# EAGLE design MOS-2 (EAGLE 8.5.2)
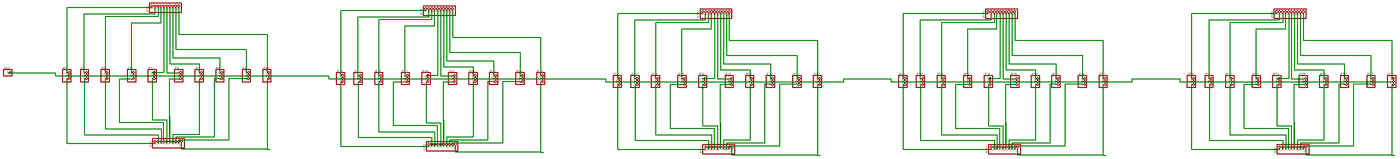
[diagram p0: schematic, sheet 1, overview]
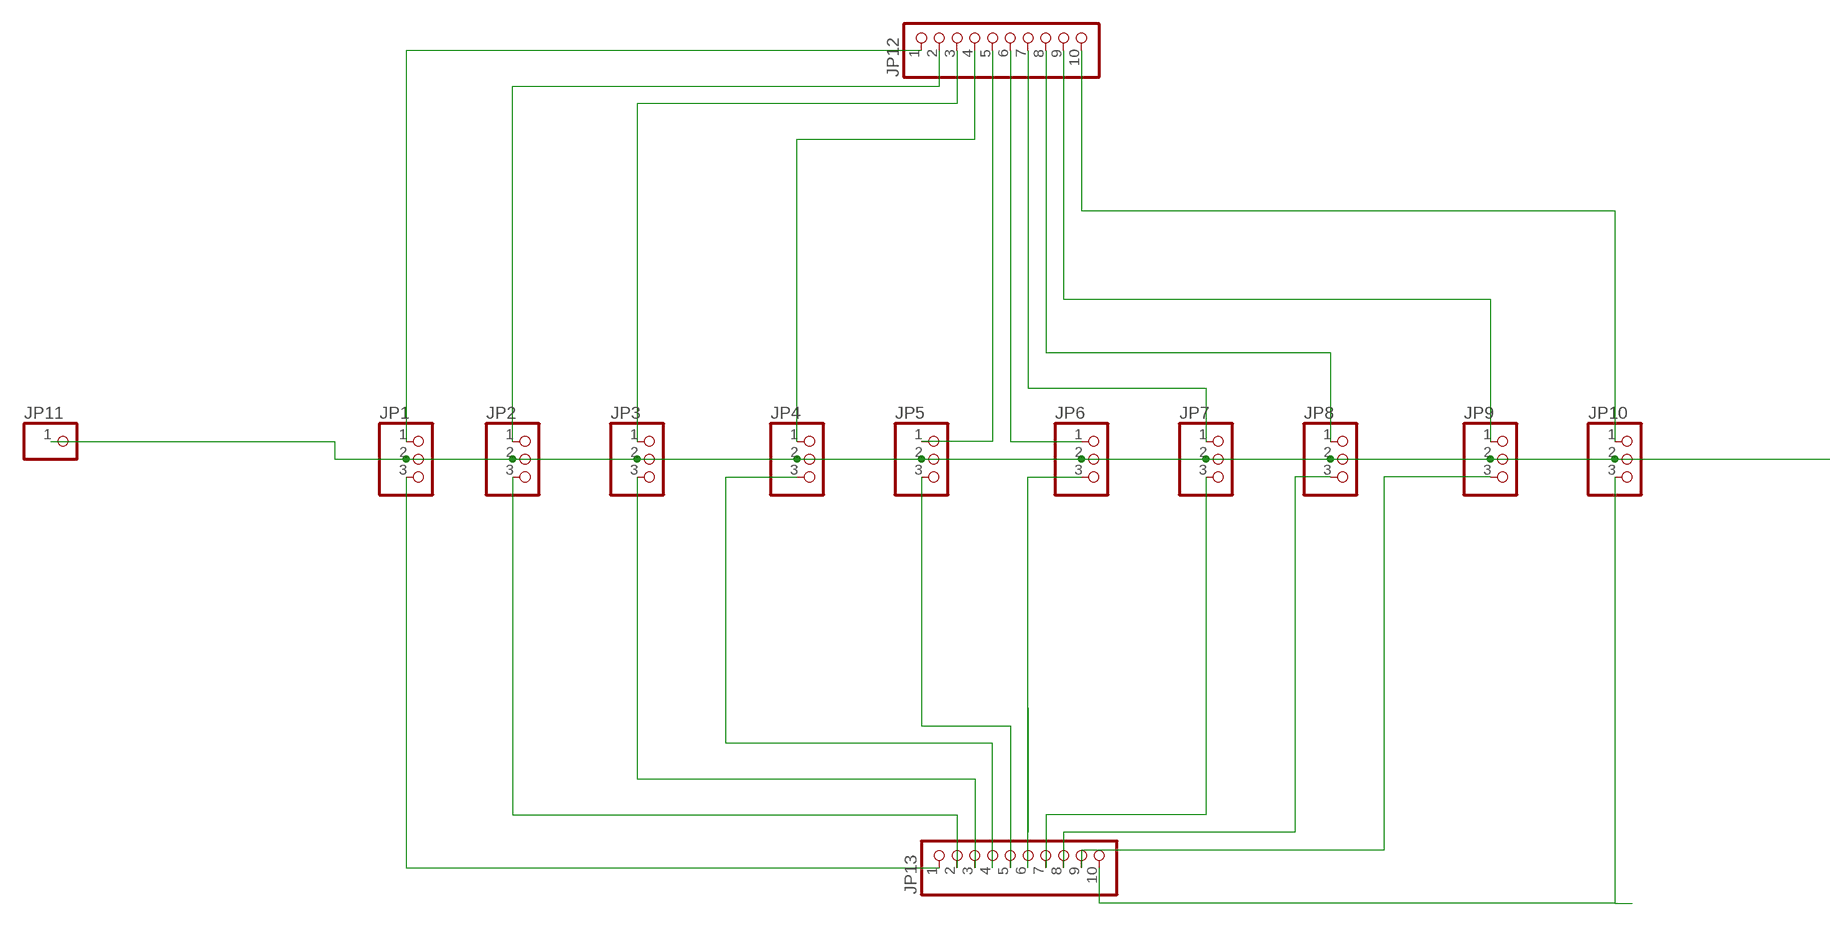
[diagram p1: schematic, sheet 1, part 1 of 4]
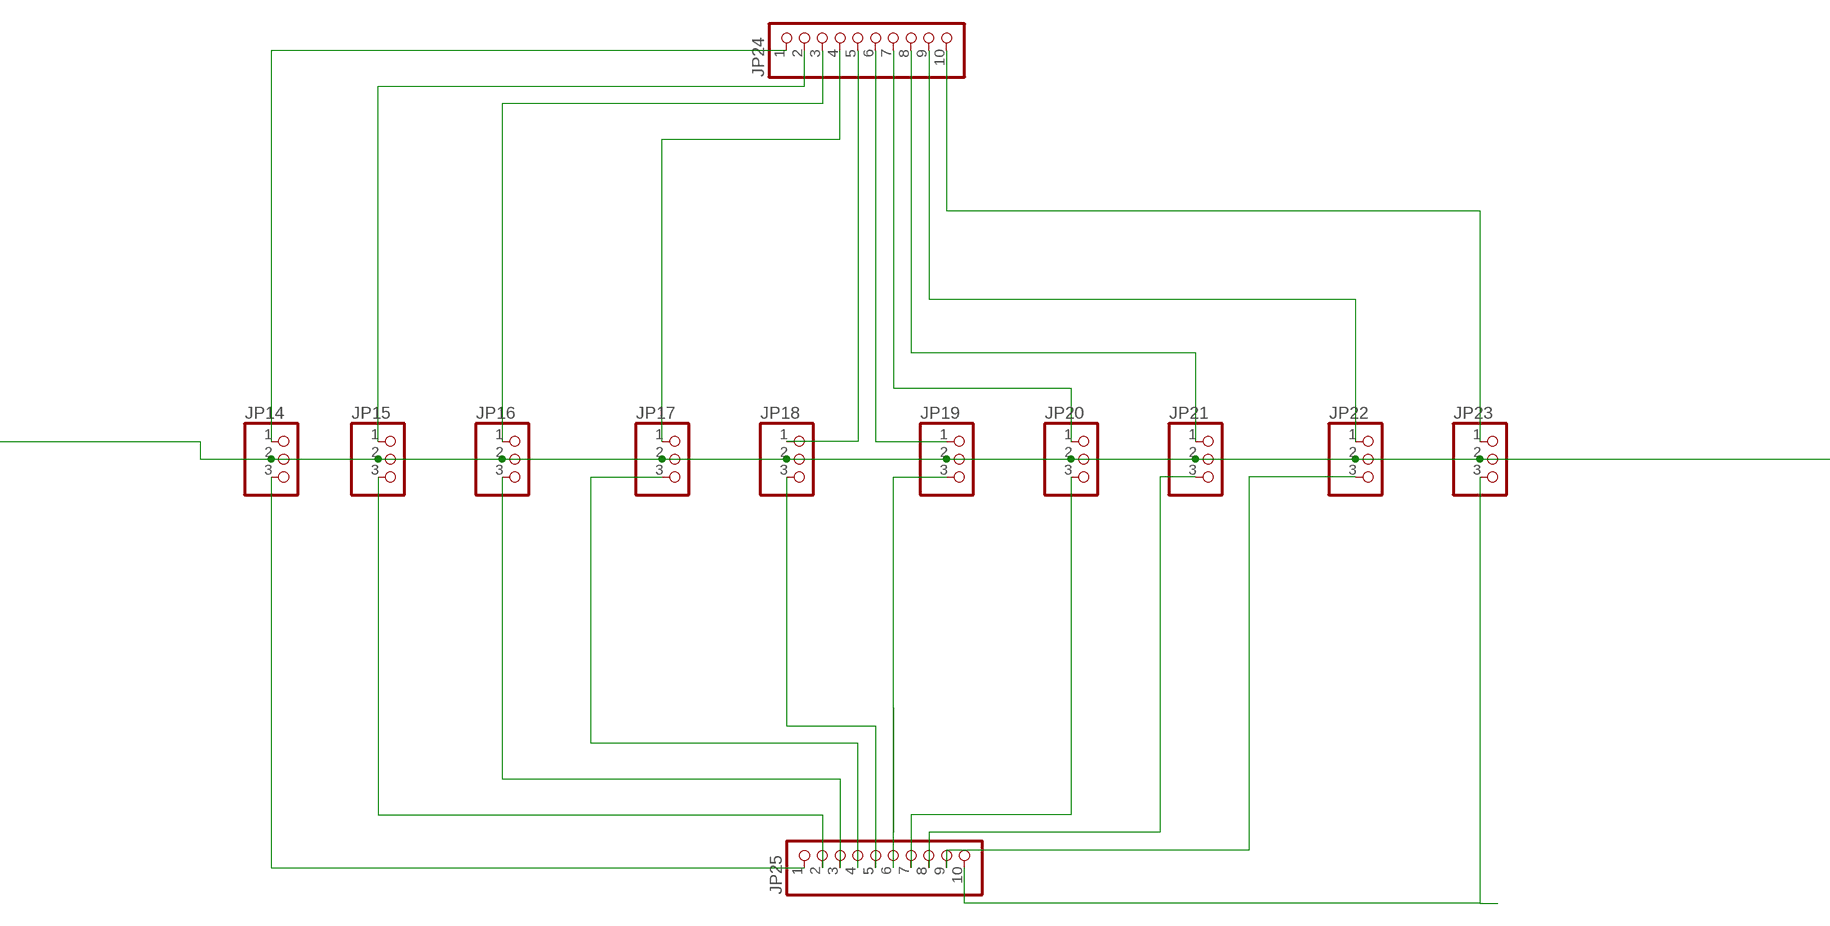
[diagram p2: schematic, sheet 1, part 2 of 4]
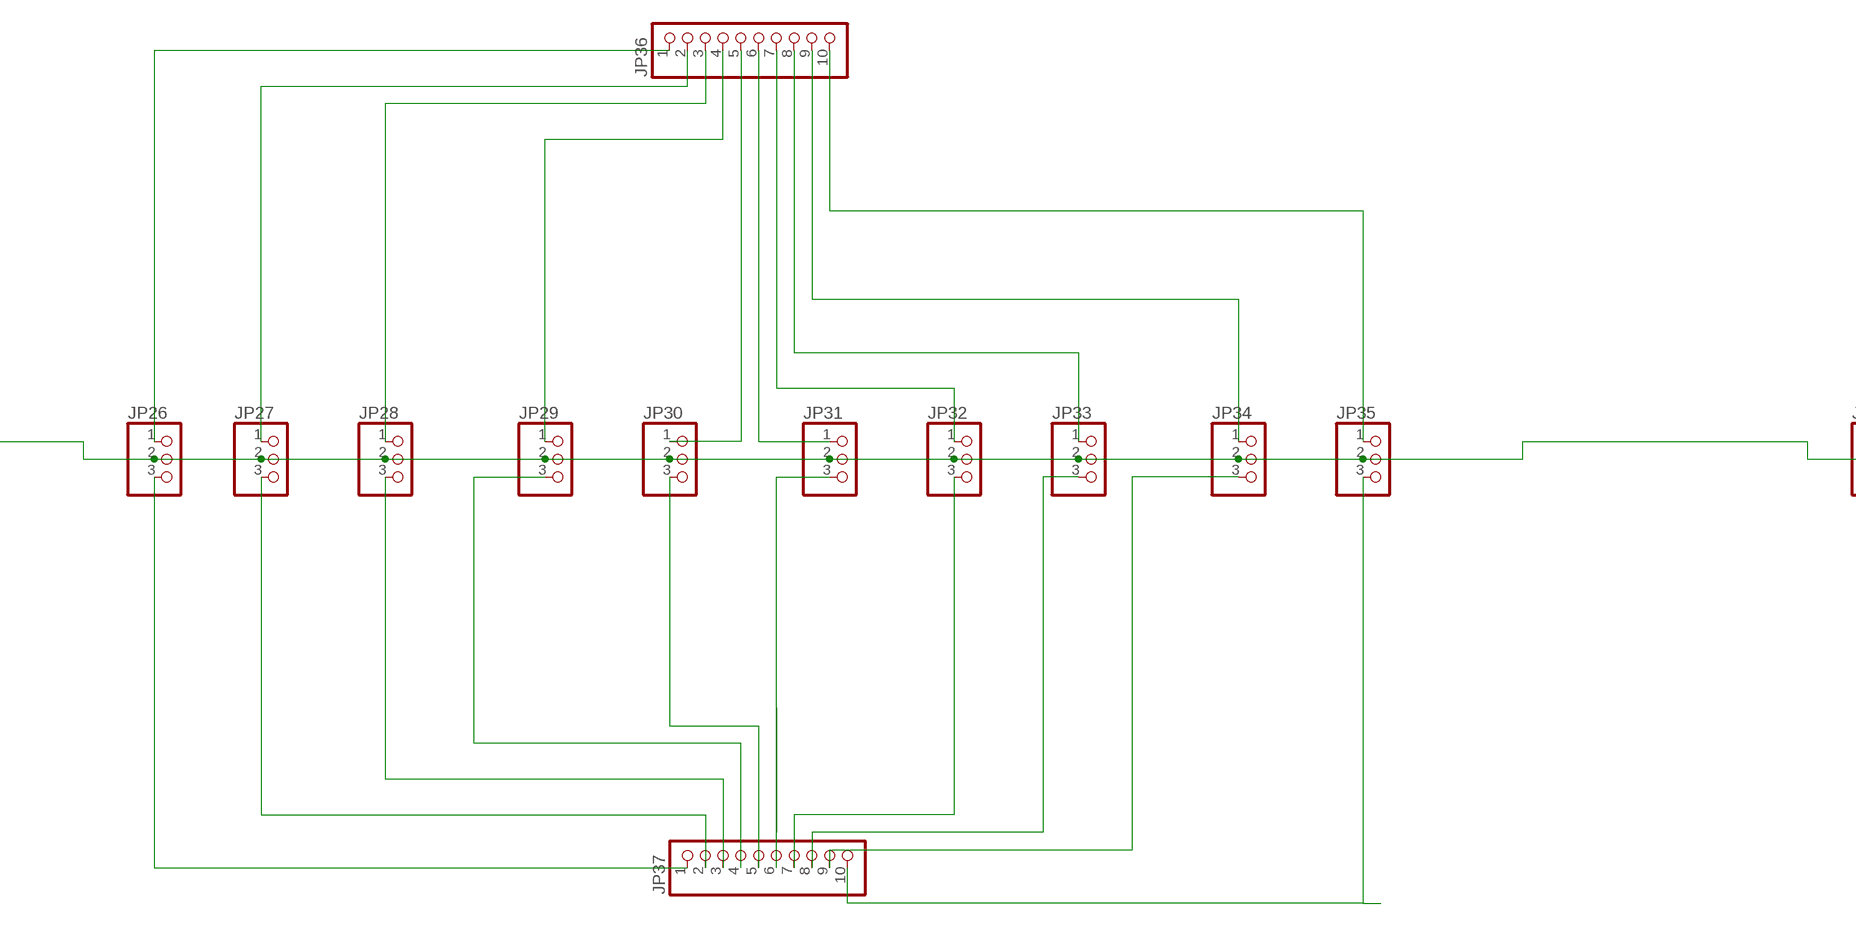
[diagram p3: schematic, sheet 1, part 3 of 4]
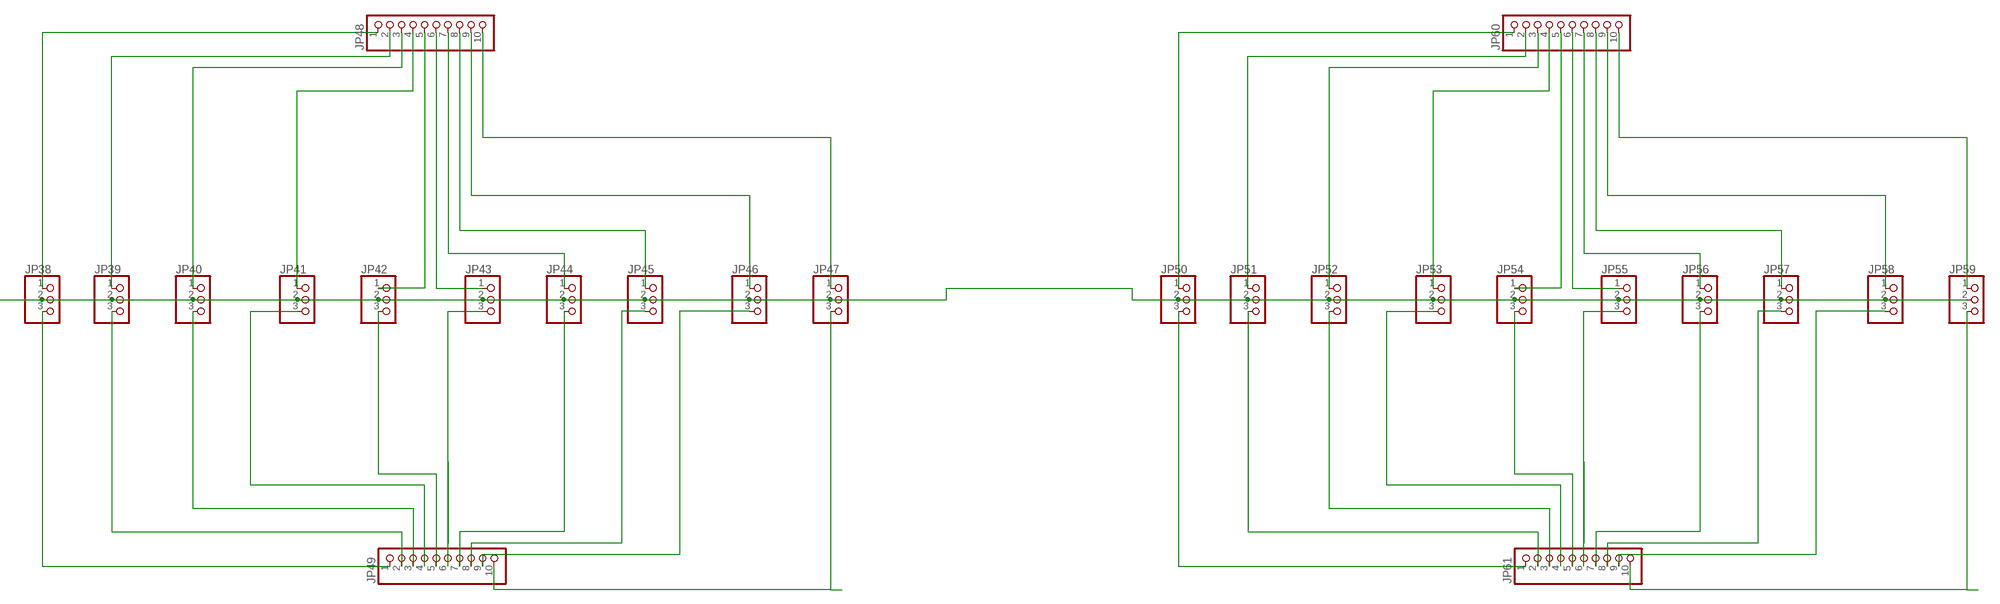
[diagram p4: schematic, sheet 1, part 4 of 4]

## Parts
JP1  PINHD-1X3  [1X03]
JP2  PINHD-1X3  [1X03]
JP3  PINHD-1X3  [1X03]
JP4  PINHD-1X3  [1X03]
JP5  PINHD-1X3  [1X03]
JP6  PINHD-1X3  [1X03]
JP7  PINHD-1X3  [1X03]
JP8  PINHD-1X3  [1X03]
JP9  PINHD-1X3  [1X03]
JP10  PINHD-1X3  [1X03]
JP11  PINHD-1X1  [1X01]
JP12  PINHD-1X10  [1X10]
JP13  PINHD-1X10  [1X10]
JP14  PINHD-1X3  [1X03]
JP15  PINHD-1X3  [1X03]
JP16  PINHD-1X3  [1X03]
JP17  PINHD-1X3  [1X03]
JP18  PINHD-1X3  [1X03]
JP19  PINHD-1X3  [1X03]
JP20  PINHD-1X3  [1X03]
JP21  PINHD-1X3  [1X03]
JP22  PINHD-1X3  [1X03]
JP23  PINHD-1X3  [1X03]
JP24  PINHD-1X10  [1X10]
JP25  PINHD-1X10  [1X10]
JP26  PINHD-1X3  [1X03]
JP27  PINHD-1X3  [1X03]
JP28  PINHD-1X3  [1X03]
JP29  PINHD-1X3  [1X03]
JP30  PINHD-1X3  [1X03]
JP31  PINHD-1X3  [1X03]
JP32  PINHD-1X3  [1X03]
JP33  PINHD-1X3  [1X03]
JP34  PINHD-1X3  [1X03]
JP35  PINHD-1X3  [1X03]
JP36  PINHD-1X10  [1X10]
JP37  PINHD-1X10  [1X10]
JP38  PINHD-1X3  [1X03]
JP39  PINHD-1X3  [1X03]
JP40  PINHD-1X3  [1X03]
JP41  PINHD-1X3  [1X03]
JP42  PINHD-1X3  [1X03]
JP43  PINHD-1X3  [1X03]
JP44  PINHD-1X3  [1X03]
JP45  PINHD-1X3  [1X03]
JP46  PINHD-1X3  [1X03]
JP47  PINHD-1X3  [1X03]
JP48  PINHD-1X10  [1X10]
JP49  PINHD-1X10  [1X10]
JP50  PINHD-1X3  [1X03]
JP51  PINHD-1X3  [1X03]
JP52  PINHD-1X3  [1X03]
JP53  PINHD-1X3  [1X03]
JP54  PINHD-1X3  [1X03]
JP55  PINHD-1X3  [1X03]
JP56  PINHD-1X3  [1X03]
JP57  PINHD-1X3  [1X03]
JP58  PINHD-1X3  [1X03]
JP59  PINHD-1X3  [1X03]
JP60  PINHD-1X10  [1X10]
JP61  PINHD-1X10  [1X10]

## Nets
N$1: JP1.2 JP2.2 JP3.2 JP4.2 JP5.2 JP6.2 JP7.2 JP8.2 JP9.2 JP10.2 JP11.1 JP14.2 JP15.2 JP16.2 JP17.2 JP18.2 JP19.2 JP20.2 JP21.2 JP22.2 JP23.2 JP26.2 JP27.2 JP28.2 JP29.2 JP30.2 JP31.2 JP32.2 JP33.2 JP34.2 JP35.2 JP38.2 JP39.2 JP40.2 JP41.2 JP42.2 JP43.2 JP44.2 JP45.2 JP46.2 JP47.2 JP50.2 JP51.2 JP52.2 JP53.2 JP54.2 JP55.2 JP56.2 JP57.2 JP58.2 JP59.2
N$2: JP1.1 JP12.1
N$3: JP2.1 JP12.2
N$4: JP3.1 JP12.3
N$5: JP4.1 JP12.4
N$6: JP5.1 JP12.5
N$7: JP6.1 JP12.6
N$8: JP7.1 JP12.7
N$9: JP8.1 JP12.8
N$10: JP9.1 JP12.9
N$11: JP10.1 JP12.10
N$12: JP1.3 JP13.1
N$13: JP2.3 JP13.2
N$14: JP3.3 JP13.3
N$16: JP5.3 JP13.5
N$17: JP10.3 JP13.10
N$18: JP9.3 JP13.9
N$19: JP8.3 JP13.8
N$20: JP7.3 JP13.7
N$21: JP6.3 JP13.6
N$22: JP14.1 JP24.1
N$23: JP4.3 JP13.4
N$24: JP15.1 JP24.2
N$26: JP16.1 JP24.3
N$27: JP17.1 JP24.4
N$28: JP18.1 JP24.5
N$29: JP19.1 JP24.6
N$30: JP20.1 JP24.7
N$31: JP21.1 JP24.8
N$32: JP22.1 JP24.9
N$33: JP23.1 JP24.10
N$34: JP14.3 JP25.1
N$35: JP15.3 JP25.2
N$36: JP16.3 JP25.3
N$37: JP18.3 JP25.5
N$38: JP23.3 JP25.10
N$39: JP22.3 JP25.9
N$40: JP21.3 JP25.8
N$41: JP20.3 JP25.7
N$42: JP19.3 JP25.6
N$43: JP17.3 JP25.4
N$46: JP26.1 JP36.1
N$47: JP27.1 JP36.2
N$48: JP28.1 JP36.3
N$49: JP29.1 JP36.4
N$50: JP30.1 JP36.5
N$51: JP31.1 JP36.6
N$52: JP32.1 JP36.7
N$53: JP33.1 JP36.8
N$54: JP34.1 JP36.9
N$55: JP35.1 JP36.10
N$56: JP26.3 JP37.1
N$57: JP27.3 JP37.2
N$58: JP28.3 JP37.3
N$59: JP30.3 JP37.5
N$60: JP35.3 JP37.10
N$61: JP34.3 JP37.9
N$62: JP33.3 JP37.8
N$63: JP32.3 JP37.7
N$64: JP31.3 JP37.6
N$65: JP29.3 JP37.4
N$68: JP38.1 JP48.1
N$69: JP39.1 JP48.2
N$70: JP40.1 JP48.3
N$71: JP41.1 JP48.4
N$72: JP42.1 JP48.5
N$73: JP43.1 JP48.6
N$74: JP44.1 JP48.7
N$75: JP45.1 JP48.8
N$76: JP46.1 JP48.9
N$77: JP47.1 JP48.10
N$78: JP38.3 JP49.1
N$79: JP39.3 JP49.2
N$80: JP40.3 JP49.3
N$81: JP42.3 JP49.5
N$82: JP47.3 JP49.10
N$83: JP46.3 JP49.9
N$84: JP45.3 JP49.8
N$85: JP44.3 JP49.7
N$86: JP43.3 JP49.6
N$87: JP41.3 JP49.4
N$90: JP50.1 JP60.1
N$91: JP51.1 JP60.2
N$92: JP52.1 JP60.3
N$93: JP53.1 JP60.4
N$94: JP54.1 JP60.5
N$95: JP55.1 JP60.6
N$96: JP56.1 JP60.7
N$97: JP57.1 JP60.8
N$98: JP58.1 JP60.9
N$99: JP59.1 JP60.10
N$100: JP50.3 JP61.1
N$101: JP51.3 JP61.2
N$102: JP52.3 JP61.3
N$103: JP54.3 JP61.5
N$104: JP59.3 JP61.10
N$105: JP58.3 JP61.9
N$106: JP57.3 JP61.8
N$107: JP56.3 JP61.7
N$108: JP55.3 JP61.6
N$109: JP53.3 JP61.4

## Library data of the parts
JP1-JP10 JP14-JP23 JP26-JP35 JP38-JP47 JP50-JP59 = pinhead:PINHD-1X3: PIN HEADER
JP11 = pinhead:PINHD-1X1: PIN HEADER
JP12 JP13 JP24 JP25 JP36 JP37 JP48 JP49 JP60 JP61 = pinhead:PINHD-1X10: PIN HEADER

## Net classes
0 default: width 1 mm, clearance 0.5 mm

## Board
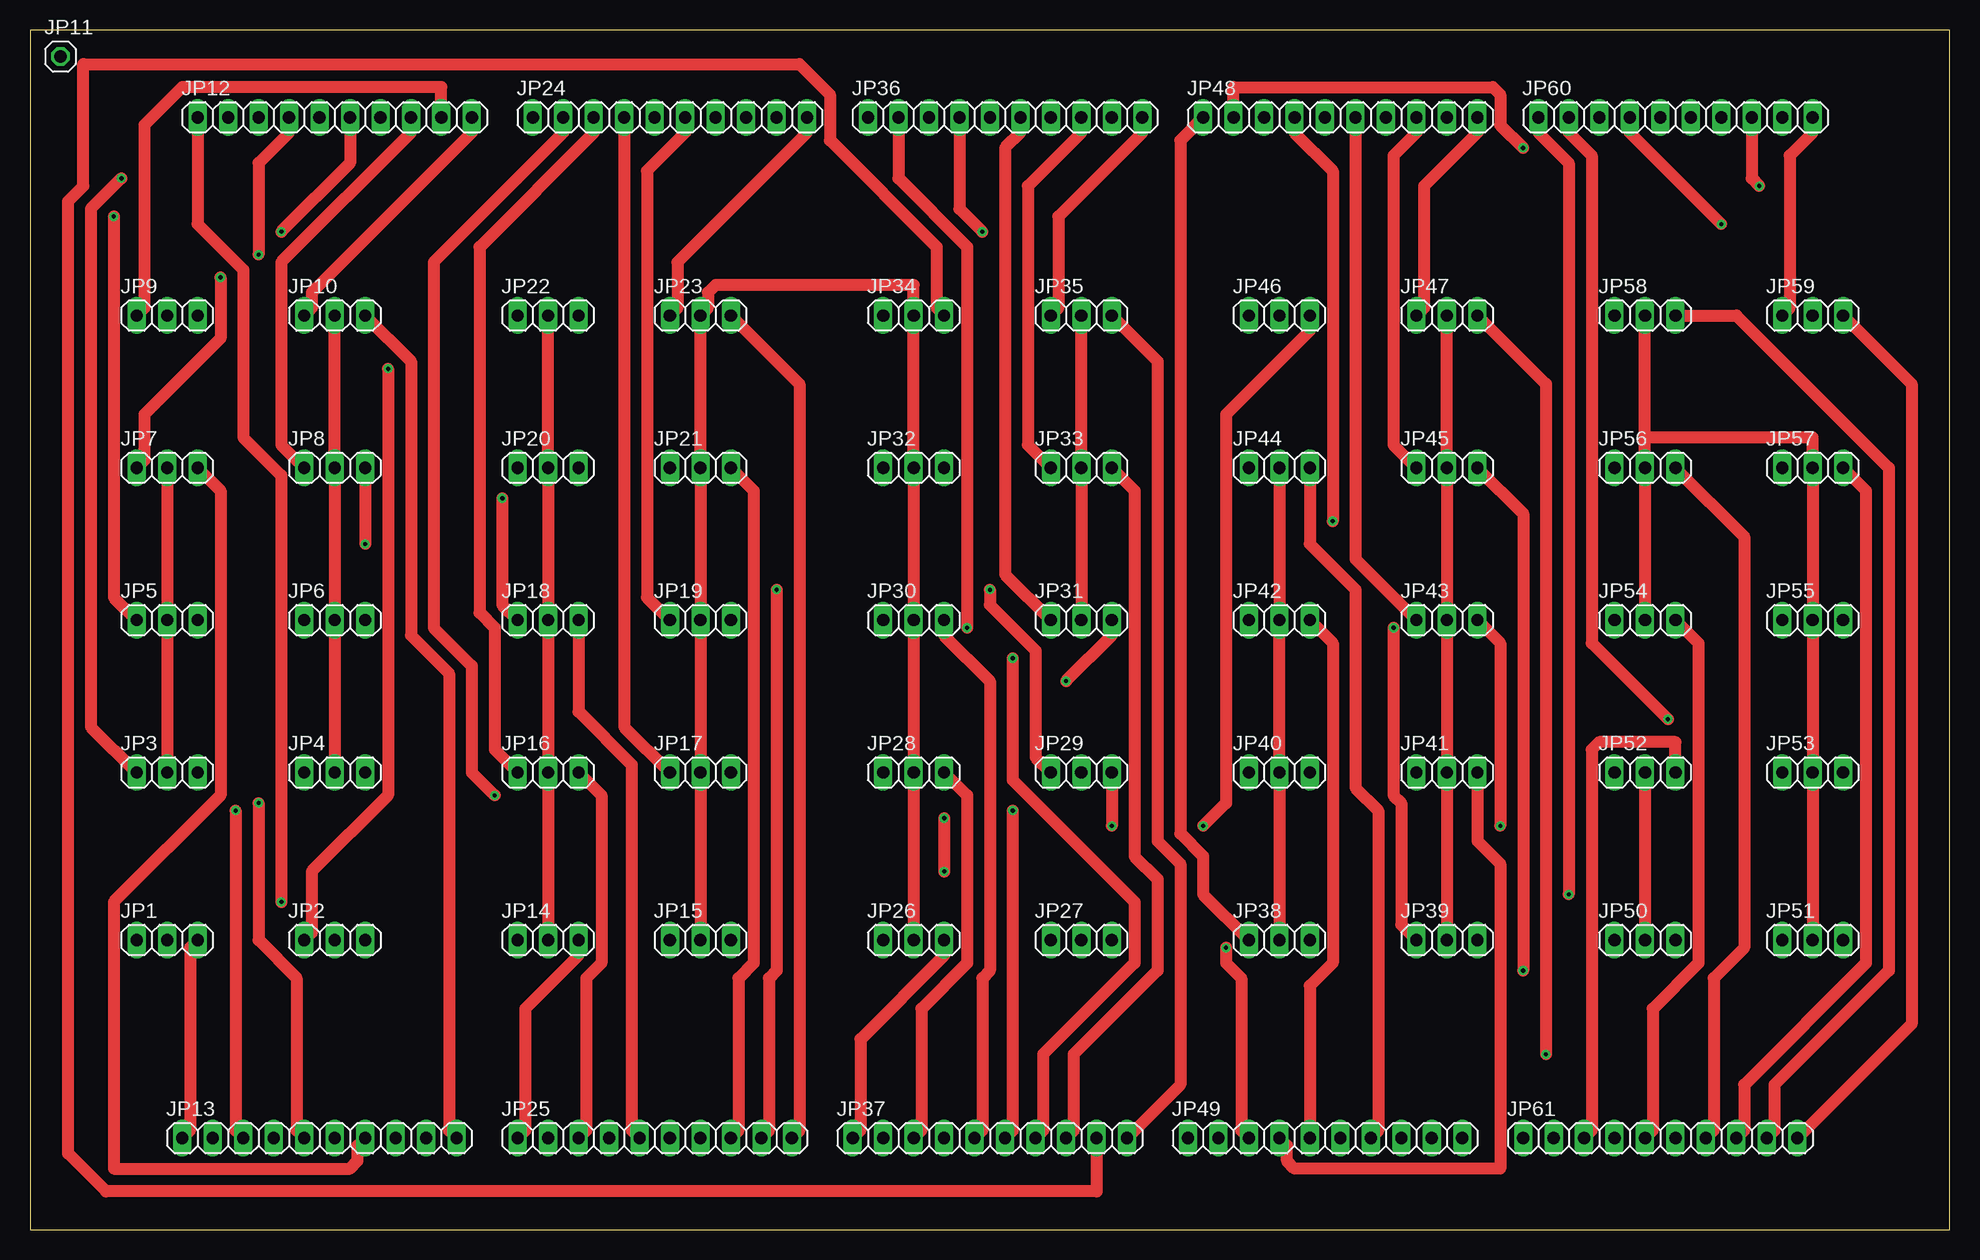
[diagram p5: board, top side]
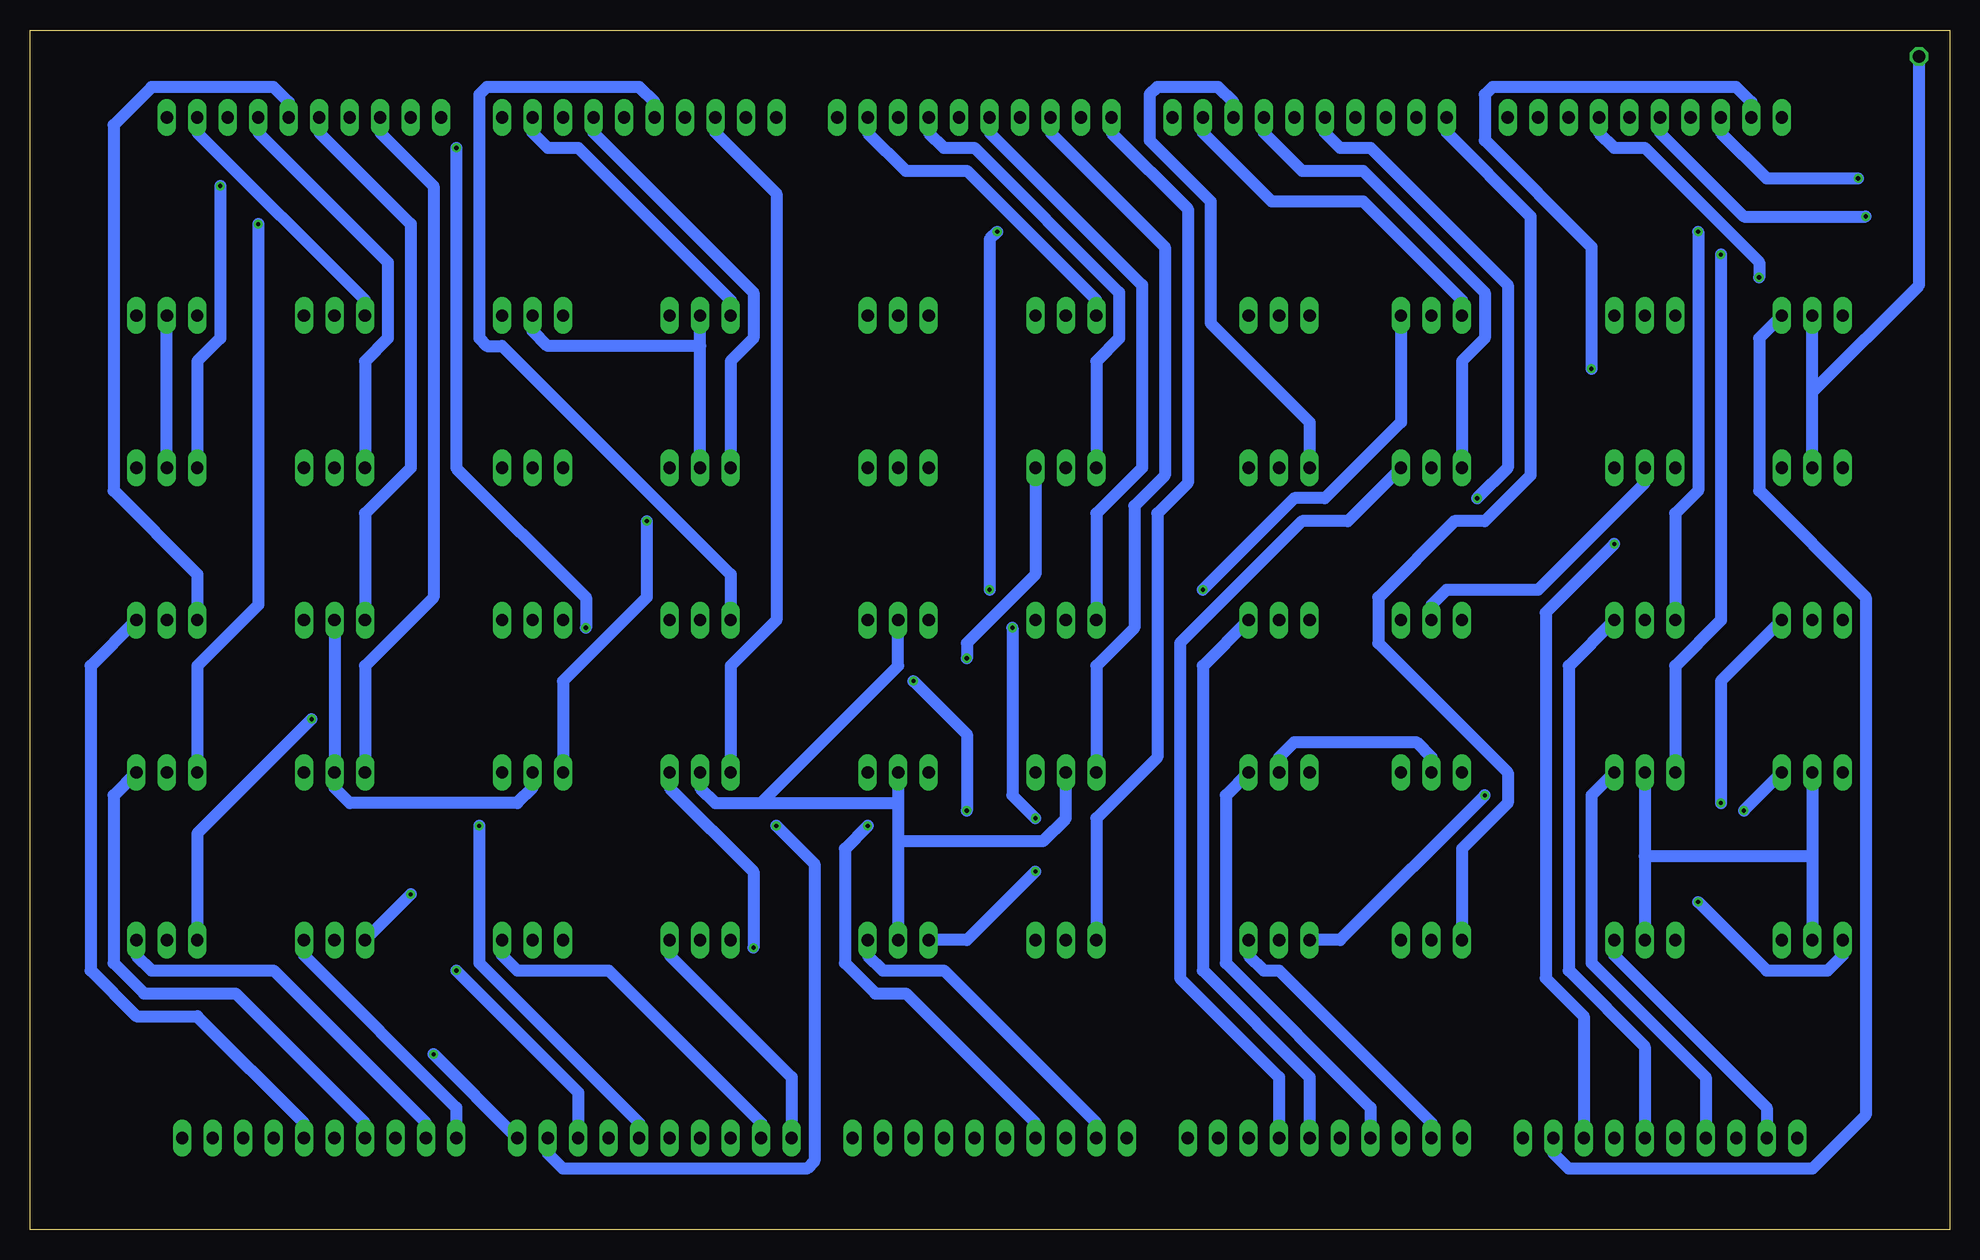
[diagram p6: board, bottom side, seen from below]

Size 160 x 100 mm. Coordinates in mm from the lower left corner, seen from the top.
Outline: 0,0 160,0 160,100 0,100 0,0
Copper layers (1*16): Top 0.035mm / dielectric 1.5mm / Bottom 0.035mm
Design rules "default": minimum track width 6mil, minimum drill 0.35mm, track to track 6mil, track to pad 6mil, pad to pad 6mil, via to via 6mil, smd to smd 6mil, copper to edge 40mil, drill to drill 6mil, minimum pad ring 10mil, minimum via ring 8mil, stop-mask expansion 4mil, vias tented up to drill 0mil, thermal gap 10mil

### Footprints (pad centres in the part's own frame; a part is rotated, then mirrored left to right if it is on the bottom)
1X03 = drill 1.016 long: 1 -2.54,0; 2 0,0; 3 2.54,0
1X01 = drill 1.016 octagon: 1 0,0
1X10 = drill 1.016 long: 1 -11.43,0; 2 -8.89,0; 3 -6.35,0; 4 -3.81,0; 5 -1.27,0; 6 1.27,0; 7 3.81,0; 8 6.35,0; 9 8.89,0; 10 11.43,0

### Placement (x,y rotation side)
JP1  11.43,24.13 0 top
JP2  25.4,24.13 0 top
JP3  11.43,38.1 0 top
JP4  25.4,38.1 0 top
JP5  11.43,50.8 0 top
JP6  25.4,50.8 0 top
JP7  11.43,63.5 0 top
JP8  25.4,63.5 0 top
JP9  11.43,76.2 0 top
JP10  25.4,76.2 0 top
JP11  2.54,97.79 0 top
JP12  25.4,92.71 0 top
JP13  24.13,7.62 0 top
JP14  43.18,24.13 0 top
JP15  55.88,24.13 0 top
JP16  43.18,38.1 0 top
JP17  55.88,38.1 0 top
JP18  43.18,50.8 0 top
JP19  55.88,50.8 0 top
JP20  43.18,63.5 0 top
JP21  55.88,63.5 0 top
JP22  43.18,76.2 0 top
JP23  55.88,76.2 0 top
JP24  53.34,92.71 0 top
JP25  52.07,7.62 0 top
JP26  73.66,24.13 0 top
JP27  87.63,24.13 0 top
JP28  73.66,38.1 0 top
JP29  87.63,38.1 0 top
JP30  73.66,50.8 0 top
JP31  87.63,50.8 0 top
JP32  73.66,63.5 0 top
JP33  87.63,63.5 0 top
JP34  73.66,76.2 0 top
JP35  87.63,76.2 0 top
JP36  81.28,92.71 0 top
JP37  80.01,7.62 0 top
JP38  104.14,24.13 0 top
JP39  118.11,24.13 0 top
JP40  104.14,38.1 0 top
JP41  118.11,38.1 0 top
JP42  104.14,50.8 0 top
JP43  118.11,50.8 0 top
JP44  104.14,63.5 0 top
JP45  118.11,63.5 0 top
JP46  104.14,76.2 0 top
JP47  118.11,76.2 0 top
JP48  109.22,92.71 0 top
JP49  107.95,7.62 0 top
JP50  134.62,24.13 0 top
JP51  148.59,24.13 0 top
JP52  134.62,38.1 0 top
JP53  148.59,38.1 0 top
JP54  134.62,50.8 0 top
JP55  148.59,50.8 0 top
JP56  134.62,63.5 0 top
JP57  148.59,63.5 0 top
JP58  134.62,76.2 0 top
JP59  148.59,76.2 0 top
JP60  137.16,92.71 0 top
JP61  135.89,7.62 0 top

### Tracks (layer width: path | path; a pad name or v marks a point on that pad's centre or on a via)
N$1
  Top 1: JP10.2 JP8.2 JP6.2 JP4.2 | JP7.2 JP5.2 JP3.2 | JP52.2 JP50.2 | JP54.2 JP56.2 134.62,66.04 | 134.62,66.04 JP58.2 | JP51.2 JP53.2 JP55.2 JP57.2 148.59,66.04 134.62,66.04 | JP14.2 JP16.2 JP18.2 JP20.2 JP22.2 | JP15.2 JP17.2 JP19.2 JP21.2 JP23.2 56.52,76.83 56.52,78.11 57.15,78.74 73.66,78.74 JP34.2 JP32.2 JP30.2 JP28.2 JP26.2 | JP39.2 JP41.2 JP43.2 JP45.2 JP47.2 | JP44.2 JP42.2 JP40.2 JP38.2 | JP31.2 JP33.2 JP35.2
  Bottom 1: JP4.2 25.4,31.11 | 25.4,31.11 JP2.2 | JP3.2 11.43,31.11 | 11.43,31.11 JP1.2 | JP7.2 11.43,69.85 | 11.43,69.85 JP9.2 | JP11.1 2.54,78.74 11.43,69.85 | 11.43,31.11 25.4,31.11 | JP54.2 JP52.2 134.62,36.83 133.35,35.56 119.38,35.56 118.11,36.83 JP41.2 | JP57.2 JP59.2 | JP16.2 43.18,39.37 44.45,40.64 54.61,40.64 55.88,39.37 JP17.2 | JP44.2 104.14,73.66 | 104.14,73.66 JP46.2 | JP29.2 87.63,35.56 | 87.63,35.56 87.63,32.38 | 87.63,32.38 JP27.2 | 99.06,35.56 102.87,35.56 104.14,36.83 JP40.2 | 99.06,35.56 87.63,35.56 | JP31.2 87.63,46.99 99.06,35.56 | JP28.2 73.66,34.29 75.56,32.38 87.63,32.38 | JP47.2 118.11,74.93 116.84,73.66 104.14,73.66 | JP8.2 25.4,62.23 34.29,53.34 41.91,53.34 43.18,52.07 JP18.2
N$2  (via drill 0.35)
  Top 1: v20.95,27.3 20.95,62.87 17.78,66.04 17.78,80.01 13.97,83.82 JP12.1
  Bottom 1: JP1.1 8.89,22.86 10.16,21.59 15.24,21.59 v20.95,27.3
N$3  (via drill 0.35)
  Top 1: JP2.1 23.5,24.77 23.5,29.84 29.84,36.2 v29.84,71.75
  Bottom 1: v29.84,71.75 29.84,81.92 38.73,90.81 38.73,94.61 38.1,95.25 17.78,95.25 16.51,93.98 JP12.2
N$4  (via drill 0.35)
  Top 1: JP3.1 5.08,41.91 5.08,85.09 v7.62,87.63
  Bottom 1: v7.62,87.63 15.24,87.63 19.05,91.44 JP12.3
N$5  (via drill 0.35)
  Top 1: v19.05,81.28 19.05,88.9 21.59,91.44 JP12.4
  Bottom 1: JP4.1 22.86,46.99 19.05,50.8 v19.05,81.28
N$6  (via drill 0.35)
  Top 1: JP5.1 6.99,52.7 v6.99,84.45
  Bottom 1: v6.99,84.45 17.14,84.45 24.13,91.44 JP12.5
N$7  (via drill 0.35)
  Top 1: v20.95,83.19 26.67,88.9 JP12.6
  Bottom 1: JP6.1 22.86,59.69 20.95,61.59 v20.95,83.19
N$8  (via drill 0.35)
  Top 1: JP7.1 9.53,64.14 9.53,67.94 15.88,74.3 v15.88,79.38
  Bottom 1: v15.88,79.38 15.88,80.64 25.4,90.17 27.94,90.17 29.21,91.44 JP12.7
N$9
  Top 1: JP8.1 20.95,65.41 20.95,80.64 31.75,91.44 JP12.8
N$10
  Top 1: JP9.1 9.53,76.83 9.53,92.08 12.7,95.25 34.29,95.25 JP12.9
N$11
  Top 1: JP10.1 23.5,76.83 23.5,78.11 36.83,91.44 JP12.10
N$12
  Top 1: JP13.1 13.34,8.26 13.34,23.5 JP1.3
N$13
  Bottom 1: JP13.2 15.24,10.16 27.94,22.86 JP2.3
N$14  (via drill 0.35)
  Top 1: JP13.3 17.14,8.26 v17.14,34.92
  Bottom 1: JP3.3 v17.14,34.92
N$16  (via drill 0.35)
  Top 1: JP13.5 22.23,8.26 22.23,20.95 19.05,24.13 v19.05,35.56
  Bottom 1: v19.05,35.56 19.05,45.72 JP5.3
N$17
  Top 1: JP13.10 34.92,8.26 34.92,46.35 31.75,49.53 31.75,72.39 JP10.3
N$18
  Bottom 1: JP13.9 33.02,6.35 31.75,5.08 11.43,5.08 6.99,9.53 6.99,52.7 15.88,61.59 15.88,74.3 JP9.3
N$19  (via drill 0.35)
  Top 1: JP8.3 v27.94,57.15
  Bottom 1: JP13.8 30.48,17.78 33.66,20.95 33.66,51.44 v27.94,57.15
N$20
  Top 1: JP13.7 27.3,6.99 27.3,5.71 26.67,5.08 6.99,5.08 6.99,27.3 15.88,36.2 15.88,61.59 JP7.3
N$21
  Bottom 1: JP13.6 25.4,15.24 31.75,21.59 31.75,46.99 JP6.3
N$22
  Bottom 1: JP14.1 40.64,31.75 36.83,35.56 36.83,38.1 47.62,48.9 47.62,52.7 41.27,59.05 38.73,59.05 34.92,62.87 34.92,84.45 41.91,91.44 JP24.1
N$23
  Bottom 1: JP13.4 20.32,12.7 29.84,22.23 29.84,36.2 JP4.3
N$24  (via drill 0.35)
  Top 1: v38.73,36.2 36.83,38.1 36.83,46.99 33.66,50.16 33.66,80.64 44.45,91.44 JP24.2
  Bottom 1: JP15.1 50.8,24.13 v38.73,36.2
N$26
  Top 1: JP16.1 38.73,40.01 38.73,50.16 37.47,51.44 37.47,81.92 46.99,91.44 JP24.3
N$27
  Top 1: JP17.1 49.53,41.91 JP24.4
N$28  (via drill 0.35)
  Top 1: JP18.1 39.37,52.07 v39.37,60.96
  Bottom 1: v39.37,60.96 36.83,63.5 36.83,78.74 48.26,90.17 50.8,90.17 52.07,91.44 JP24.5
N$29
  Top 1: JP19.1 51.44,52.7 51.44,88.27 54.61,91.44 JP24.6
N$30
  Bottom 1: JP20.1 40.64,72.39 38.73,74.3 38.73,78.11 48.9,88.27 53.98,88.27 57.15,91.44 JP24.7
N$31
  Bottom 1: JP21.1 53.34,67.31 61.59,75.56 61.59,85.72 66.67,90.81 66.67,94.61 66.04,95.25 60.96,95.25 59.69,93.98 JP24.8
N$32
  Bottom 1: JP22.1 40.64,77.47 48.9,85.72 56.52,85.72 62.23,91.44 JP24.9
N$33
  Top 1: JP23.1 53.98,76.83 53.98,80.64 64.77,91.44 JP24.10
N$34
  Top 1: JP25.1 41.27,8.26 41.27,18.41 45.72,22.86 JP14.3
N$35
  Bottom 1: JP25.2 43.18,8.89 55.88,21.59 57.15,21.59 58.42,22.86 JP15.3
N$36
  Top 1: JP25.3 46.35,8.26 46.35,20.95 47.62,22.23 47.62,36.2 JP16.3
N$37
  Top 1: JP25.5 50.16,8.26 50.16,38.73 45.72,43.18 JP18.3
N$38
  Top 1: JP25.10 64.14,8.26 64.14,70.48 JP23.3
N$39  (via drill 0.35)
  Top 1: JP25.9 61.59,8.26 61.59,20.95 62.23,21.59 v62.23,53.34
  Bottom 1: v62.23,53.34 54.61,60.96 52.07,60.96 45.72,67.31 JP22.3
N$40
  Top 1: JP25.8 59.05,8.26 59.05,20.95 60.33,22.23 60.33,61.59 JP21.3
N$41
  Bottom 1: JP25.7 55.88,12.7 64.14,20.95 64.14,48.9 53.98,59.05 50.16,59.05 JP20.3
N$42
  Bottom 1: JP25.6 53.34,12.7 62.23,21.59 62.23,46.99 JP19.3
N$43
  Bottom 1: JP25.4 48.26,10.16 60.33,22.23 60.33,36.2 JP17.3
N$46
  Bottom 1: JP26.1 71.12,34.29 66.04,39.37 66.04,59.69 63.5,62.23 63.5,85.09 69.85,91.44 JP36.1
N$47  (via drill 0.35)
  Top 1: v76.2,34.29 v76.2,29.84 | v78.11,50.16 78.11,81.92 72.39,87.63 JP36.2
  Bottom 1: JP27.1 81.92,24.13 v76.2,29.84 | v76.2,34.29 78.11,36.2 v78.11,50.16
N$48
  Bottom 1: JP28.1 71.12,46.99 67.94,50.16 67.94,60.33 65.41,62.87 65.41,81.92 74.93,91.44 JP36.3
N$49  (via drill 0.35)
  Top 1: JP29.1 83.82,39.37 83.82,48.26 80.01,52.07 v80.01,53.34 | v79.38,83.19 77.47,85.09 JP36.4
  Bottom 1: v80.01,53.34 80.01,82.55 v79.38,83.19
N$50
  Bottom 1: JP30.1 71.12,59.69 67.31,63.5 67.31,78.74 80.01,91.44 JP36.5
N$51
  Top 1: JP31.1 81.28,54.61 81.28,90.17 82.55,91.44 JP36.6
N$52
  Bottom 1: JP32.1 71.12,72.39 69.22,74.3 69.22,78.11 81.28,90.17 83.82,90.17 85.09,91.44 JP36.7
N$53
  Top 1: JP33.1 83.19,65.41 83.19,87 87.63,91.44 JP36.8
N$54
  Bottom 1: JP34.1 71.12,77.47 81.92,88.27 87,88.27 90.17,91.44 JP36.9
N$55
  Top 1: JP35.1 85.72,76.83 85.72,84.45 92.71,91.44 JP36.10
N$56
  Top 1: JP37.1 69.22,8.26 69.22,15.88 76.2,22.86 JP26.3
N$57
  Bottom 1: JP37.2 71.12,8.89 83.82,21.59 88.9,21.59 90.17,22.86 JP27.3
N$58
  Top 1: JP37.3 74.3,8.26 74.3,18.41 78.11,22.23 78.11,36.2 JP28.3
N$59
  Top 1: JP37.5 79.38,8.26 79.38,20.95 80.01,21.59 80.01,45.72 76.2,49.53 JP30.3
N$60
  Top 1: JP37.10 95.89,12.06 95.89,30.48 93.98,32.38 93.98,72.39 JP35.3
N$61
  Top 1: JP34.3 75.56,76.83 75.56,81.92 66.67,90.81 66.67,94.61 64.14,97.16 4.45,97.16 4.45,87 3.17,85.72 3.17,6.35 6.35,3.17 88.9,3.17 JP37.9
N$62
  Top 1: JP37.8 87,8.26 87,14.61 93.98,21.59 93.98,29.21 92.08,31.11 92.08,61.59 JP33.3
N$63  (via drill 0.35)
  Top 1: JP37.7 84.45,8.26 84.45,14.61 92.08,22.23 92.08,27.3 81.92,37.47 v81.92,47.62
  Bottom 1: v81.92,47.62 81.92,48.9 76.2,54.61 JP32.3
N$64  (via drill 0.35)
  Top 1: JP37.6 81.92,8.26 v81.92,34.92 | v86.36,45.72 90.17,49.53 JP31.3
  Bottom 1: v81.92,34.92 81.92,41.27 v86.36,45.72
N$65  (via drill 0.35)
  Top 1: JP29.3 v90.17,33.66
  Bottom 1: JP37.4 76.2,8.89 87,19.68 89.53,19.68 92.08,22.23 92.08,31.75 v90.17,33.66
N$68
  Top 1: JP38.1 97.79,27.94 97.79,31.11 95.89,33.02 95.89,90.81 JP48.1
N$69  (via drill 0.35)
  Top 1: JP39.1 114.3,25.4 114.3,35.56 113.67,36.2 v113.67,50.16 | v124.46,90.17 122.56,92.08 122.56,94.61 121.92,95.25 100.33,95.25 JP48.2
  Bottom 1: v113.67,50.16 113.67,52.7 124.46,63.5 v124.46,90.17
N$70
  Bottom 1: JP40.1 101.6,46.99 97.79,50.8 97.79,86.36 102.87,91.44 JP48.3
N$71  (via drill 0.35)
  Top 1: v108.58,59.05 108.58,88.27 105.41,91.44 JP48.4
  Bottom 1: JP41.1 115.57,45.72 108.58,52.7 v108.58,59.05
N$72
  Bottom 1: JP42.1 101.6,54.61 120.65,73.66 121.92,73.66 122.56,74.3 122.56,94.61 121.92,95.25 109.22,95.25 107.95,93.98 JP48.5
N$73
  Top 1: JP43.1 110.49,55.88 JP48.6
N$74
  Bottom 1: JP44.1 101.6,72.39 99.69,74.3 99.69,78.11 113.03,91.44 JP48.7
N$75
  Top 1: JP45.1 113.67,65.41 113.67,89.53 115.57,91.44 JP48.8
N$76
  Bottom 1: JP46.1 101.6,77.47 114.3,90.17 116.84,90.17 118.11,91.44 JP48.9
N$77
  Top 1: JP47.1 116.2,76.83 116.2,87 120.65,91.44 JP48.10
N$78
  Bottom 1: JP49.1 96.52,12.7 106.68,22.86 JP38.3
N$79
  Bottom 1: JP49.2 99.06,8.89 111.76,21.59 119.38,21.59 120.65,22.86 JP39.3
N$80  (via drill 0.35)
  Top 1: JP49.3 100.97,8.26 100.97,20.95 99.69,22.23 v99.69,23.5
  Bottom 1: v99.69,23.5 99.69,29.84 106.68,36.83 JP40.3
N$81
  Top 1: JP49.5 106.68,20.32 108.58,22.23 108.58,48.9 JP42.3
N$82  (via drill 0.35)
  Top 1: v126.36,14.61 126.36,70.48 JP47.3
  Bottom 1: v126.36,14.61 JP49.10
N$83  (via drill 0.35)
  Top 1: v97.79,33.66 99.69,35.56 99.69,67.94 106.68,74.93 JP46.3
  Bottom 1: JP49.9 116.84,6.35 115.57,5.08 95.25,5.08 94.61,5.71 94.61,30.48 v97.79,33.66
N$84  (via drill 0.35)
  Top 1: v124.46,21.59 124.46,59.69 JP45.3
  Bottom 1: JP49.8 114.3,11.43 v124.46,21.59
N$85
  Top 1: JP49.7 112.39,8.26 112.39,34.92 110.49,36.83 110.49,53.34 106.68,57.15 JP44.3
N$86  (via drill 0.35)
  Top 1: v122.56,33.66 122.56,48.9 JP43.3
  Bottom 1: JP49.6 109.22,8.89 122.56,22.23 v122.56,33.66
N$87
  Top 1: JP49.4 104.78,6.99 104.78,5.71 105.41,5.08 122.56,5.08 122.56,30.48 120.65,32.38 JP41.3
N$90  (via drill 0.35)
  Top 1: v128.27,27.94 128.27,88.9 125.73,91.44 JP60.1
  Bottom 1: v128.27,27.94 JP50.1
N$91  (via drill 0.35)
  Top 1: v136.53,42.55 130.18,48.9 130.18,89.53 128.27,91.44 JP60.2
  Bottom 1: JP51.1 146.05,33.02 v136.53,42.55
N$92
  Bottom 1: JP52.1 132.08,46.99 126.36,52.7 126.36,87 130.81,91.44 JP60.3
N$93  (via drill 0.35)
  Top 1: v140.97,83.82 133.35,91.44 JP60.4
  Bottom 1: JP53.1 146.05,46.99 140.97,52.07 v140.97,83.82
N$94
  Bottom 1: JP54.1 132.08,59.69 128.27,63.5 128.27,83.82 135.89,91.44 JP60.5
N$95
  Bottom 1: JP55.1 146.05,54.61 153.03,61.59 153.03,92.08 149.86,95.25 139.7,95.25 138.43,93.98 JP60.6
N$96
  Bottom 1: JP56.1 132.08,72.39 130.18,74.3 130.18,80.64 140.97,91.44 JP60.7
N$97  (via drill 0.35)
  Top 1: v144.15,87 143.51,87.63 JP60.8
  Bottom 1: JP57.1 146.05,72.39 144.15,74.3 v144.15,87
N$98
  Bottom 1: JP58.1 132.08,77.47 146.05,91.44 JP60.9
N$99
  Top 1: JP59.1 146.69,76.83 146.69,89.53 148.59,91.44 JP60.10
N$100
  Bottom 1: JP61.1 124.46,10.16 137.16,22.86 JP50.3
N$101
  Bottom 1: JP61.2 127,8.89 139.7,21.59 149.86,21.59 151.13,22.86 JP51.3
N$102
  Top 1: JP61.3 130.18,8.26 130.18,40.01 130.81,40.64 137.16,40.64 JP52.3
N$103
  Top 1: JP61.5 135.25,8.26 135.25,18.41 139.06,22.23 139.06,48.9 JP54.3
N$104
  Top 1: JP61.10 156.84,17.14 156.84,70.48 JP59.3
N$105
  Top 1: JP61.9 145.41,8.26 145.41,12.06 154.94,21.59 154.94,63.5 142.24,76.2 JP58.3
N$106
  Top 1: JP61.8 142.88,8.26 142.88,12.06 153.03,22.23 153.03,61.59 JP57.3
N$107
  Top 1: JP61.7 140.34,8.26 140.34,20.95 142.88,23.5 142.88,57.78 JP56.3
N$108
  Bottom 1: JP61.6 137.16,8.89 146.05,17.78 151.13,17.78 154.94,21.59 154.94,46.99 JP55.3
N$109
  Bottom 1: JP61.4 132.08,8.89 142.88,19.68 150.5,19.68 153.03,22.23 153.03,36.2 JP53.3